# EAGLE design 100mADSR (EAGLE 7.6.0)
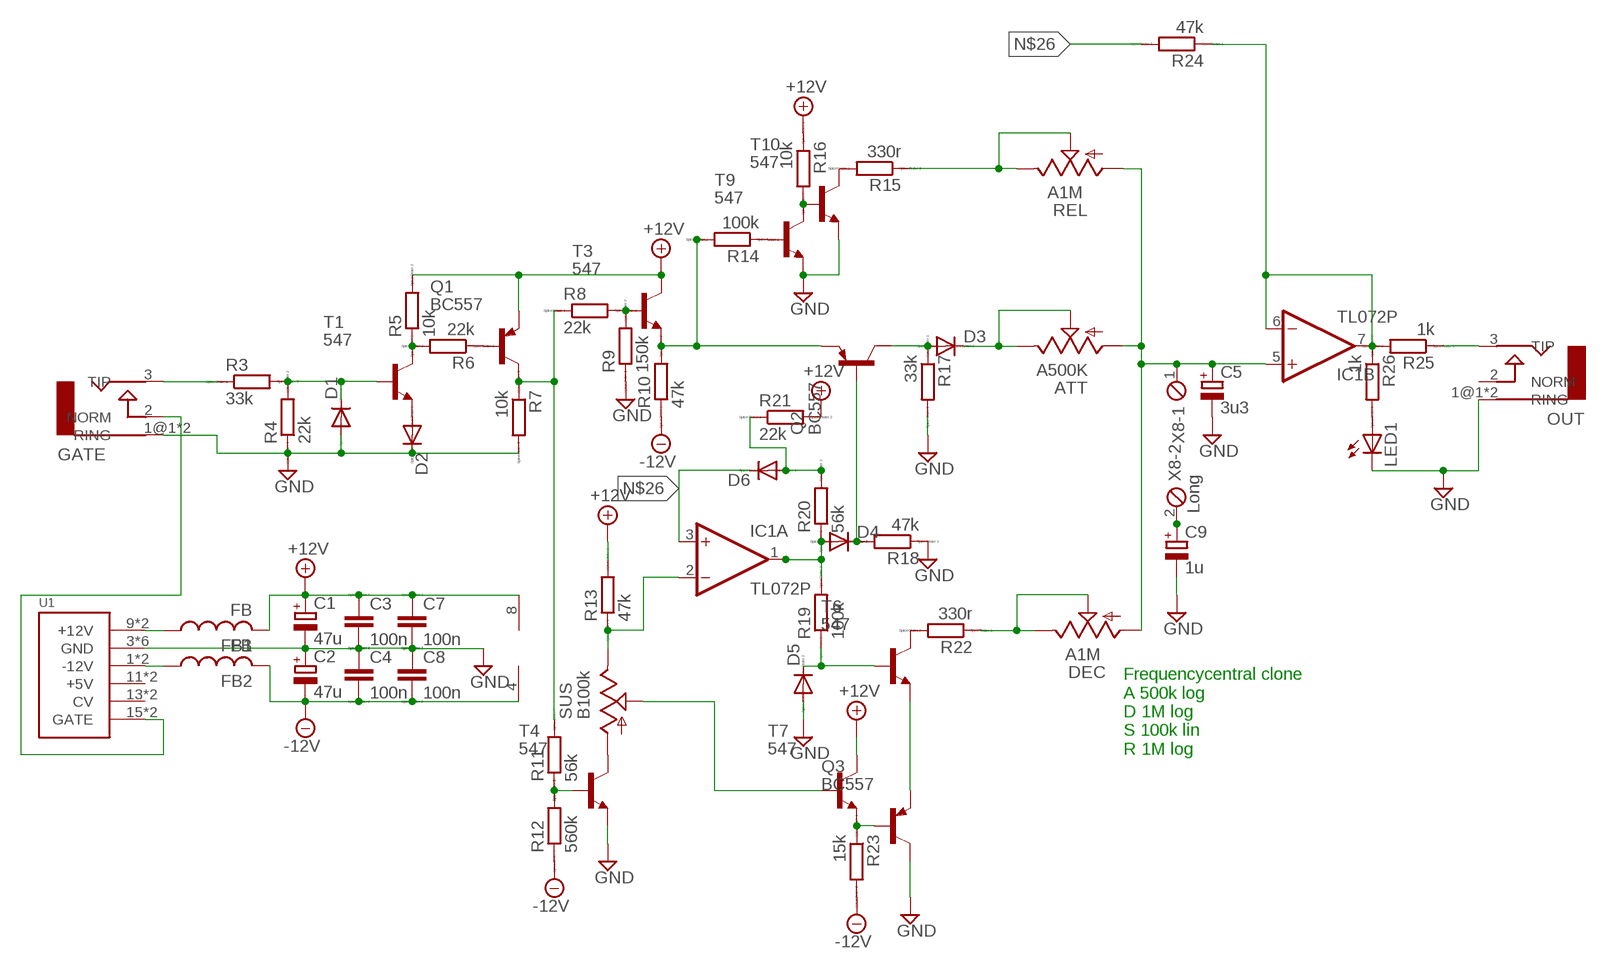
[diagram p0: schematic, sheet 1]

## Parts
ATT  A500K  TRIMSLIDE45  [SLIDEPOT-45]
C1  47u  CPOL-EUE2.5-7  [E2,5-7]
C2  47u  CPOL-EUE2.5-7  [E2,5-7]
C3  100n  C-EU025-025X050  [C025-025X050]
C4  100n  C-EU025-025X050  [C025-025X050]
C5  3u3  CPOL-EUE2.5-6  [E2,5-6]
C7  100n  C-EUC1206K  [C1206K]
C8  100n  C-EUC1206K  [C1206K]
C9  1u  CPOL-EUE2.5-6  [E2,5-6]
D1  1N4148DO35-7  [DO35-7]
D2  1N4148DO35-7  [DO35-7]
D3  1N4148DO35-7  [DO35-7]
D4  1N4148DO35-7  [DO35-7]
D5  1N4148DO35-7  [DO35-7]
D6  1N4148DO35-7  [DO35-7]
DEC  A1M  TRIMSLIDE45  [SLIDEPOT-45]
FB1  FB  [FB]
FB2  FB  [FB]
GATE  AUDIO-JACKERTHENVAR  [ERTHENVAR-JACK]
IC1  TL072P  [DIL08]
LED1  LED3MM  [LED3MM]
OUT  AUDIO-JACKERTHENVAR  [ERTHENVAR-JACK]
Q1  BC557  [TO92-EBC]
Q2  BC557  [TO92-EBC]
Q3  BC557  [TO92-EBC]
R3  33k  R-EU_0204_7  [0204/7]
R4  22k  R-EU_0204_7  [0204/7]
R5  10k  R-EU_0204_7  [0204/7]
R6  22k  R-EU_0204_7  [0204/7]
R7  10k  R-EU_0204_7  [0204/7]
R8  22k  R-EU_0204_7  [0204/7]
R9  150k  R-EU_0204_7  [0204/7]
R10  47k  R-EU_0204_7  [0204/7]
R11  56k  R-EU_0204_7  [0204/7]
R12  560k  R-EU_0204_7  [0204/7]
R13  47k  R-EU_0204_7  [0204/7]
R14  100k  R-EU_0204_7  [0204/7]
R15  330r  R-EU_0204_7  [0204/7]
R16  10k  R-EU_0204_7  [0204/7]
R17  33k  R-EU_0204_7  [0204/7]
R18  47k  R-EU_0204_7  [0204/7]
R19  100k  R-EU_0204_7  [0204/7]
R20  56k  R-EU_0204_7  [0204/7]
R21  22k  R-EU_0204_7  [0204/7]
R22  330r  R-EU_0204_7  [0204/7]
R23  15k  R-EU_0204_7  [0204/7]
R24  47k  R-EU_0204_7  [0204/7]
R25  1k  R-EU_0204_7  [0204/7]
R26  1k  R-EU_0204_7  [0204/7]
REL  A1M  TRIMSLIDE45  [SLIDEPOT-45]
SUS  B100k  TRIMSLIDE45  [SLIDEPOT-45]
T1  547  BC547-NPN-TO92-CBE  [TO92-CBE]
T3  547  BC547-NPN-TO92-CBE  [TO92-CBE]
T4  547  BC547-NPN-TO92-CBE  [TO92-CBE]
T6  547  BC547-NPN-TO92-CBE  [TO92-CBE]
T7  547  BC547-NPN-TO92-CBE  [TO92-CBE]
T9  547  BC547-NPN-TO92-CBE  [TO92-CBE]
T10  547  BC547-NPN-TO92-CBE  [TO92-CBE]
U1  POWER  [POWER_16]
X8  Long  MPT2  [2POL254]

## Nets
+12V: C1.+ C3.1 C7.1 FB1.P$2 IC1.8(P:V+) Q1.E R5.2 R13.2 R16.1 R21.2 T3.C T7.C
-12V: C2.- C4.2 C8.2 FB2.P$2 IC1.4(P:V-) R10.1 R12.1 R23.2
GND: C1.- C2.+ C3.2 C4.1 C5.- C7.2 C8.1 C9.- D1.A D2.C D5.A GATE.1@1(RING) GATE.1@2(RING) LED1.K(C) OUT.1@1(RING) OUT.1@2(RING) Q3.C R4.1 R7.2 R9.1 R17.2 R18.1 T4.E T9.E T10.E U1.3(GND) U1.4(GND) U1.5(GND) U1.6(GND) U1.7(GND) U1.8(GND)
N$1: OUT.3(TIP) R25.1
N$2: R14.1 T9.B
N$3: R16.2 T9.C T10.B
N$4: R15.2 T10.C
N$5: R15.1 REL.B REL.WIPER
N$6: SUS.A T4.C
N$7: D3.A Q2.C R17.1
N$8: D4.C Q2.B R18.2
N$9: D1.C R3.2 R4.2 T1.B
N$10: Q1.B R6.1
N$11: R5.1 R6.2 T1.C
N$12: R11.1 R12.2 T4.B
N$13: GATE.2(NORM) U1.15(GATE) U1.16(GATE)
N$14: IC1.2(A:-IN) R13.1 SUS.B
N$15: D6.A R20.2 R21.1
N$16: D2.A T1.E
N$17: Q1.C R7.1 R8.1 R11.2
N$18: D4.A IC1.1(A:OUT) R19.2 R20.1
N$19: R8.2 R9.2 T3.B
N$20: Q2.E R10.2 R14.2 T3.E
N$21: D5.C R19.1 T6.B
N$22: R22.2 T6.C
N$23: Q3.E T6.E
N$24: Q3.B R23.1 T7.E
N$25: SUS.WIPER T7.B
N$26: D6.C IC1.3(A:+IN) R24.2
N$27: LED1.A R26.2
N$28: ATT.B ATT.WIPER D3.C
N$29: DEC.B DEC.WIPER R22.1
N$30: ATT.A C5.+ DEC.A IC1.5(B:+IN) REL.A X8.1
N$31: IC1.6(B:-IN) IC1.7(B:OUT) R24.1 R25.2 R26.1
N$32: GATE.3(TIP) R3.1
N$37: C9.+ X8.2
N$61: FB1.P$1 U1.9(+12V) U1.10(+12V)
N$62: FB2.P$1 U1.1(-12V) U1.2(-12V)
Unconnected: OUT.2(NORM) U1.11(+5V) U1.12(+5V) U1.13(CV) U1.14(CV)

## Notes on the sheet
- Frequencycentral clone
  A 500k log
  D 1M log
  S 100k lin
  R 1M log

## Library data of the parts
ATT DEC REL SUS = stefan-lochbrunner_EAGLE_master_custom libraries_potentiometers_Bourns PTA series_Bourns PTA series:TRIM: Sliding potentiometers Based on Adafruits (https://github.com/adafruit/Adafruit-Eagle-Library) 'TRIM' device. For Bourns PTA series and TT Electronics PSxx series potentiometers.
C1 C2 C5 C9 = resistor:CPOL-EU: POLARIZED CAPACITOR, European symbol
C3 C4 C7 C8 = resistor:C-EU: CAPACITOR, European symbol; SPICEPREFIX: C
D1-D6 = diode:1N4148: DIODE high speed (Philips)
FB1 FB2 = adafruit:FB: Ferrite bead Digikey #P9821BK-ND
GATE OUT = erthenvar:AUDIO-JACK: Switching Mono 3.5mm Audio Jack from Erthenvar.
IC1 = gm-ics:TL072: OP AMP
LED1 = led:LED: LED OSRAM: - CHIPLED LG R971, LG N971, LY N971, LG Q971, LY Q971, LO R971, LY R971 LH N974, LH R974 LS Q976, LO Q976, LY Q976 LO Q996 - Hyper CHIPLED LW Q18S LB Q993, LB Q99A, LB R99A - SideLED LS A670, LO A670, LY A670, LG A670, LP A670 LB A673, LV A673, LT A673, LW A673 LH A674 LY A675 LS A676, LA A676, LO A676, LY A676, LW A676 LS A679, LY A679, LG A679 - Hyper Micro SIDELED® LS Y876, LA Y876, LO Y876, LY Y876 LT Y87S - SmartLED LW L88C, LW L88S LB L89C, LB L89S, LG L890 LS L89K, LO L89K, LY L89K LS L896, LA L896, LO L896, LY L896 - TOPLED LS T670, LO T670, LY T670, LG T670, LP T670 LSG T670, LSP T670, LSY T670, LOP T670, LYG T670 LG T671, LOG T671, LSG T671 LB T673, LV T673, LT T673, LW T673 LH T674 LS T676, LA T676, LO T676, LY T676, LB T676, LH T676, LSB T676, LW T676 LB T67C, LV T67C, LT T67C, LS T67K, LO T67K, LY T67K, LW E67C LS E67B, LA E67B, LO E67B, LY E67B, LB E67C, LV E67C, LT E67C LW T67C LS T679, LY T679, LG T679 LS T770, LO T770, LY T770, LG T770, LP T770 LB T773, LV T773, LT T773, LW T773 LH T774 LS E675, LA E675, LY E675, LS T675 LS T776, LA T776, LO T776, LY T776, LB T776 LHGB T686 LT T68C, LB T68C - Hyper Mini TOPLED® LB M676 - Mini TOPLED Santana® LG M470 LS M47K, LO M47K, LY M47K Source: http://www.osram.convergy.de LUXEON: - LUMILED® LXK2-PW12-R00, LXK2-PW12-S00, LXK2-PW14-U00, LXK2-PW14-V00 LXK2-PM12-R00, LXK2-PM12-S00, LXK2-PM14-U00 LXK2-PE12-Q00, LXK2-PE12-R00, LXK2-PE12-S00, LXK2-PE14-T00, LXK2-PE14-U00 LXK2-PB12-K00, LXK2-PB12-L00, LXK2-PB12-M00, LXK2-PB14-N00, LXK2-PB14-P00, LXK2-PB14-Q00 LXK2-PR12-L00, LXK2-PR12-M00, LXK2-PR14-Q00, LXK2-PR14-R00 LXK2-PD12-Q00, LXK2-PD12-R00, LXK2-PD12-S00 LXK2-PH12-R00, LXK2-PH12-S00 LXK2-PL12-P00, LXK2-PL12-Q00, LXK2-PL12-R00 Source: www.luxeon.com KINGBRIGHT: KA-3528ASYC Source: www.kingbright.com
Q1-Q3 = transistor-pnp:BC557*: PNP Transistror
R3-R26 = resistor:R-EU_: RESISTOR, European symbol; SPICEPREFIX: R
T1 T3 T4 T6 T7 T9 T10 = transistor:*-NPN-: NPN Transistror BF959 corrected 2008.03.06
U1 = eurorack:POWER
X8 = con-phoenix-254:MPT2: PHOENIX CONNECTOR; OC_FARNELL: unknown; OC_NEWARK: unknown

## Board
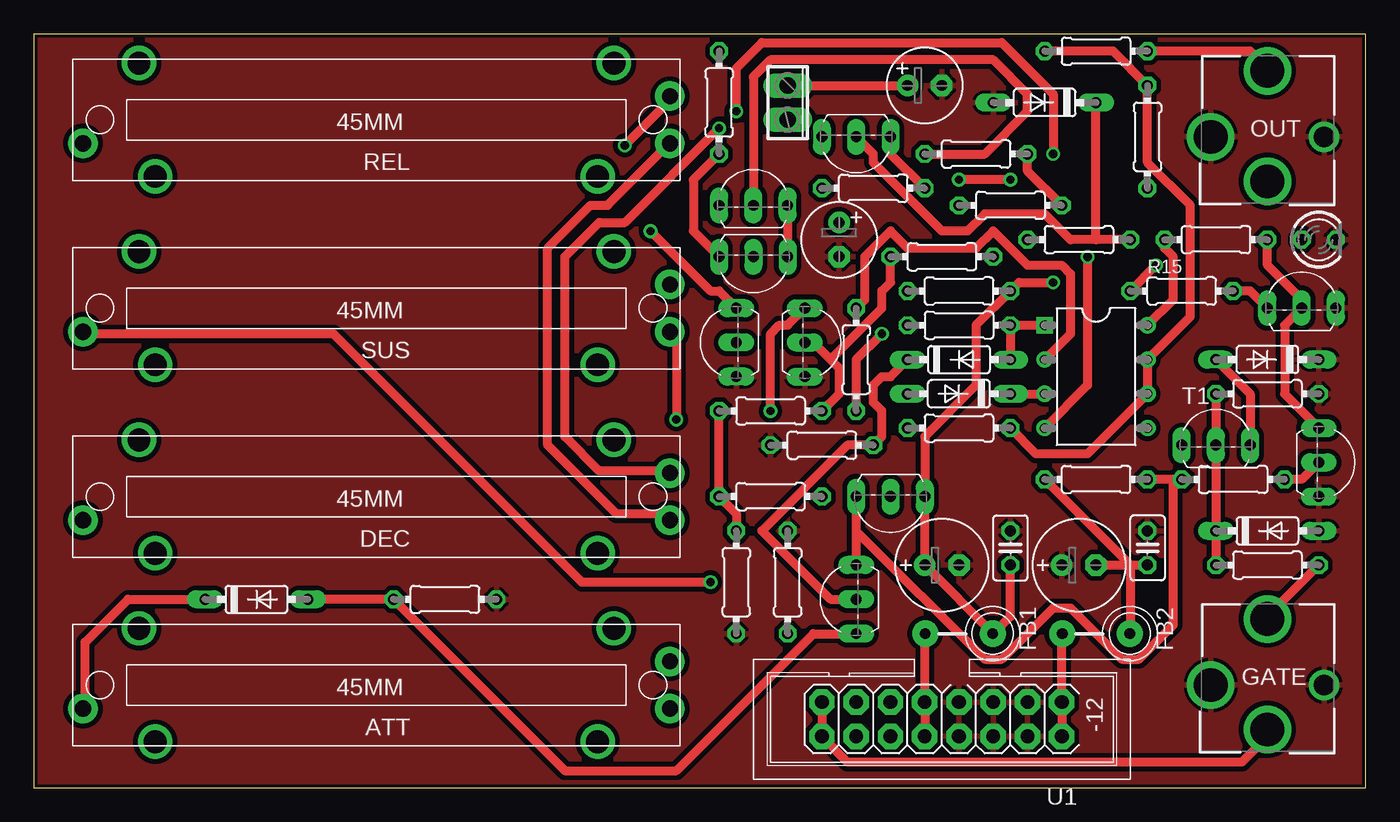
[diagram p1: board, top side]
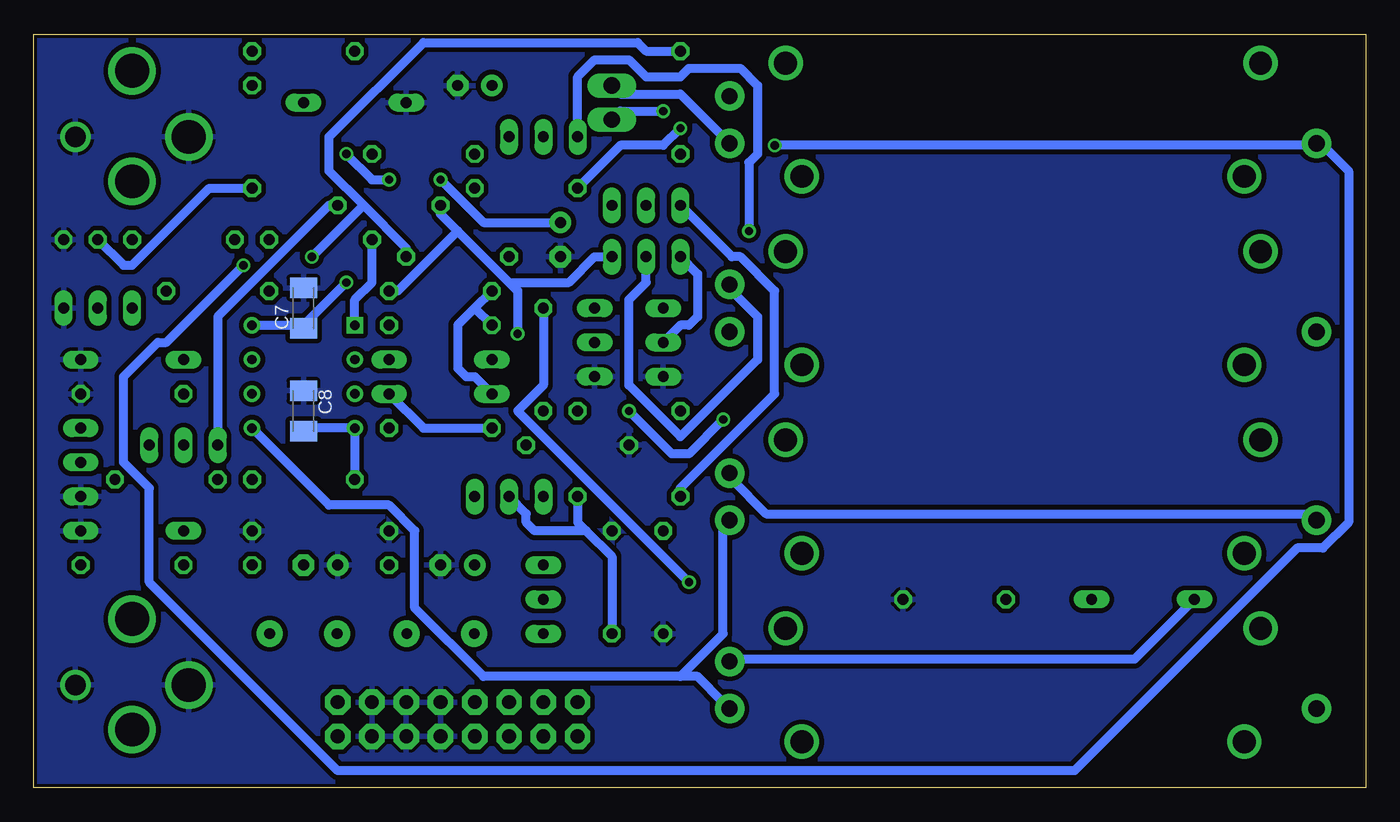
[diagram p2: board, bottom side, seen from below]

Size 98.73 x 55.87 mm. Coordinates in mm from the lower left corner, seen from the top.
Outline: 0,0 98.73,0 98.73,55.87 0,55.87 0,0
Copper layers (1*16): Top 0.035mm / dielectric 1.5mm / Bottom 0.035mm
Design rules "default *": minimum track width 26mil, minimum drill 24mil, track to track 14mil, track to pad 14mil, pad to pad 14mil, via to via 14mil, smd to smd 8mil, copper to edge 10mil, drill to drill 14mil, minimum pad ring 10mil, minimum via ring 8mil, stop-mask expansion 4mil, vias tented up to drill 0mil, thermal gap 10mil

### Footprints (pad centres in the part's own frame; a part is rotated, then mirrored left to right if it is on the bottom)
SLIDEPOT-45 = drill 1.2 pad 2.184: A -21.75,1.75; B 21.75,1.75; WIPER -21.75,-1.75 | drill 1.7 pad 2.54: P$1 -16.4,4.2; P$2 16.4,4.2; P$3 -17.6,-4.2; P$4 17.6,-4.2
E2,5-7 = drill 0.813 pad 1.6: + -1.27,0 | drill 0.813 pad 1.6 octagon: - 1.27,0
C025-025X050 = drill 0.813 octagon: 1 -1.27,0; 2 1.27,0
E2,5-6 = drill 0.813 pad 1.6: + -1.27,0 | drill 0.813 pad 1.6 octagon: - 1.27,0
C1206K = smd 1.5 x 2: 1 -1.5,0; 2 1.5,0
DO35-7 = drill 0.813 long: A 3.81,0; C -3.81,0
FB = drill 0.8 pad 1.93: P$1 -2.5,0; P$2 2.5,0
ERTHENVAR-JACK = drill 2.5: 1@1 -4.2,0; 2 0,-3.3; 3 0,4.9 | drill 1.5: 1@2 4.2,0
DIL08 = drill 0.7 square: 1 -3.81,-3.81 | drill 0.7: 2 -1.27,-3.81; 3 1.27,-3.81; 4 3.81,-3.81; 5 3.81,3.81; 6 1.27,3.81; 7 -1.27,3.81; 8 -3.81,3.81
LED3MM = drill 0.813 octagon: A -1.27,0; K 1.27,0
TO92-EBC = drill 0.813 long: B 0,-1.27; C -2.54,-1.27; E 2.54,-1.27
0204/7 = drill 0.813 octagon: 1 -3.81,0; 2 3.81,0
TO92-CBE = drill 0.813 long: B 0,0; C -2.54,0; E 2.54,0
POWER_16 = drill 1.016 pad 1.88 octagon: 1 -6.35,-1.27; 2 -6.35,1.27; 3 -3.81,-1.27; 4 -3.81,1.27; 5 -1.27,-1.27; 6 -1.27,1.27; 7 1.27,-1.27; 8 1.27,1.27; 9 3.81,-1.27; 10 3.81,1.27; 11 6.35,-1.27; 12 6.35,1.27; 13 8.89,-1.27; 14 8.89,1.27; 15 11.43,-1.27; 16 11.43,1.27
2POL254 = drill 1.2 long: 1 -1.27,0; 2 1.27,0

### Placement (x,y rotation side)
ATT  25.4,7.62 180 top
C1  67.31,16.51 0 top
C2  77.47,16.51 0 top
C3  72.39,17.78 90 top
C4  82.55,17.78 270 top
C5  66.04,52.07 0 top
C7  78.74,35.56 90 bottom
C8  78.74,27.94 270 bottom
C9  59.69,40.64 270 top
D1  91.44,19.05 0 top
D2  91.44,31.75 180 top
D3  16.51,13.97 0 top
D4  68.58,31.75 0 top
D5  74.93,50.8 180 top
D6  68.58,29.21 180 top
DEC  25.4,21.59 180 top
FB1  68.58,11.43 0 top
FB2  78.74,11.43 0 top
GATE  91.44,7.62 0 top
IC1  78.74,30.48 270 top
LED1  95.25,40.64 0 top
OUT  91.44,48.26 0 top
Q1  53.34,44.45 0 top
Q2  59.69,13.97 90 top
Q3  50.8,33.02 90 top
R3  91.44,16.51 180 top
R4  91.44,29.21 180 top
R5  72.39,43.18 180 top
R6  69.85,46.99 0 top
R7  52.07,15.24 270 top
R8  54.61,21.59 0 top
R9  55.88,15.24 270 top
R10  78.74,22.86 0 top
R11  54.61,27.94 180 top
R12  67.31,39.37 180 top
R13  60.96,31.75 270 top
R14  88.9,22.86 180 top
R15  85.09,36.83 0 top
R16  87.63,40.64 0 top
R17  30.48,13.97 0 top
R18  58.42,25.4 0 top
R19  77.47,40.64 180 top
R20  68.58,34.29 180 top
R21  68.58,36.83 0 top
R22  62.23,44.45 0 top
R23  50.8,50.8 90 top
R24  68.58,26.67 180 top
R25  78.74,54.61 180 top
R26  82.55,48.26 270 top
REL  25.4,49.53 180 top
SUS  25.4,35.56 180 top
T1  87.63,25.4 0 top
T3  63.5,21.59 180 top
T4  57.15,33.02 270 top
T6  60.96,48.26 180 top
T7  53.34,39.37 180 top
T9  95.25,24.13 270 top
T10  93.98,35.56 0 top
U1  69.85,5.08 180 top
X8  55.88,50.8 270 top

### Tracks (layer width: path | path; a pad name or v marks a point on that pad's centre or on a via)
+12V  (via drill 0.61)
  Top 0.66: C3.1 72.39,12.7 71.12,11.43 | 71.12,11.43 C1.+ T3.C 66.04,26.04 69.85,29.84 69.85,34.29 R21.2 73.03,37.47 v75.56,37.47 | 71.12,11.43 FB1.P$2 | R16.1 83.82,40.01 84.45,39.37 84.45,36.2 IC1.8 | Q1.E T7.C | R13.2 60.96,31.75 v62.87,33.66
  Bottom 0.66: IC1.8 78.74,34.29 | v62.87,33.66 62.87,36.83 63.5,37.47 | 67.31,41.27 68.58,42.55 R5.2 | 67.31,41.27 63.5,37.47 | R21.2 71.75,36.83 67.31,41.27 | T7.C 57.15,39.37 59.05,37.47 63.5,37.47 | v75.56,37.47 78.74,34.29 | 78.74,34.29 C7.1
-12V  (via drill 0.61)
  Top 0.66: C2.- 81.28,16.51 | 81.28,16.51 C4.2 | 81.28,16.51 81.28,11.43 FB2.P$2 | 81.28,16.51 R10.1 | IC1.4 78.11,29.84 v78.11,39.37
  Bottom 0.66: C8.2 78.74,26.67 IC1.4 R10.1 | R23.2 53.34,54.61 53.98,55.24 69.85,55.24 76.83,48.26 76.83,45.72 74.3,43.18 | 74.3,43.18 71.12,40.01 R12.1 | 74.3,43.18 v78.11,39.37
GND
  pour Bottom: 0,59.69 99.06,59.69 99.06,0 0,0
  pour Top: -1.27,59.69 100.33,59.69 100.33,-1.27 -1.27,-1.27
N$1
  Top 0.66: R25.1 90.17,54.61 91.44,53.34 OUT.3
N$2
  Top 0.66: R14.1 93.98,22.86 T9.B
N$3
  Top 0.66: T9.C 92.71,29.21 92.71,34.29 T10.B 93.98,36.2 91.44,38.73 R16.2
N$4
  Top 0.66: R15.2 90.17,36.83 T10.C
N$5  (via drill 0.61)
  Top 0.66: v83.19,38.73 R15.1 | v43.81,47.62 46.99,50.8 REL.WIPER
  Bottom 0.66: v83.19,38.73 88.9,33.02 89.53,33.02 92.08,30.48 92.08,24.13 90.17,22.23 90.17,15.24 76.2,1.27 21.59,1.27 5.08,17.78 3.17,17.78 1.27,19.68 1.27,45.72 3.17,47.62 REL.B 3.81,47.62 v43.81,47.62
N$6  (via drill 0.61)
  Top 0.66: T4.C 55.88,34.29 55.24,34.29 54.61,33.66 v54.61,27.94 | v47.62,27.3 47.62,33.66 SUS.A
  Bottom 0.66: v54.61,27.94 51.44,24.77 50.16,24.77 v47.62,27.3
N$7
  Top 0.66: D3.A R17.1 39.37,1.27 47.62,1.27 57.78,11.43 Q2.C
N$8
  Top 0.66: Q2.B 59.05,13.97 53.98,19.05 60.33,25.4 R18.2 62.87,26.04 62.87,27.94 62.23,28.57 62.23,29.84 62.87,30.48 63.5,30.48 D4.C
N$9
  Top 0.66: R3.2 D1.C T1.B R4.2
N$10
  Top 0.66: Q1.B 53.34,52.7 54.61,53.98 71.12,53.98 73.66,51.44 73.66,50.16 70.48,46.99 R6.1
N$11
  Top 0.66: R6.2 73.66,45.72 R5.1
  Bottom 0.66: T1.C 85.09,34.92 76.83,43.18 R5.1
N$12
  Top 0.66: R11.1 59.69,29.21 59.69,31.11 59.05,31.75 | 59.05,31.75 57.78,33.02 T4.B | R12.2 63.5,37.47 62.87,36.83 62.87,35.56 59.05,31.75
N$13
  Top 0.66: U1.15 U1.16 60.33,1.91 89.53,1.91 91.44,3.81 GATE.2
N$14  (via drill 0.61)
  Top 0.66: IC1.2 76.83,33.66 76.83,38.1 76.2,38.73 73.66,38.73 71.12,41.27 69.85,40.01 64.77,40.01 63.5,41.27 61.59,39.37 61.59,36.2 R13.1 | v50.16,15.24 40.64,15.24 22.23,33.66 3.81,33.66 SUS.B
  Bottom 0.66: v50.16,15.24 62.87,27.94 60.96,29.84 R13.1
N$15
  Bottom 0.66: D6.A 66.04,30.48 66.67,30.48 67.31,31.11 67.31,34.29 66.04,35.56 | R21.1 66.04,35.56 | 66.04,35.56 R20.2
N$16
  Top 0.66: T1.E 90.17,29.21 D2.A
N$17
  Top 0.66: R7.1 52.07,20.32 R8.1 R11.2
  Bottom 0.66: Q1.C 46.99,39.37 46.35,39.37 43.81,36.83 43.81,29.21 50.8,22.23 R8.1
N$18
  Top 0.66: IC1.1 R20.1 D4.A
  Bottom 0.66: R19.2 73.66,37.47 74.93,36.2 IC1.1
N$19
  Bottom 0.66: R9.2 55.88,17.14 57.78,19.05 | 57.78,19.05 58.42,19.68 R8.2 | T3.B 62.23,20.32 62.23,19.68 61.59,19.05 57.78,19.05
N$20
  Top 0.66: 84.45,22.86 R10.2 | T3.E 60.96,19.05 | 60.96,19.05 Q2.E | 84.45,22.86 84.45,12.06 81.92,9.53 80.64,9.53 76.83,13.34 75.56,13.34 71.75,9.53 70.48,9.53 60.96,19.05 | 84.45,22.86 R14.2
N$21
  Top 0.66: T6.B 62.23,46.99 62.23,46.35 67.31,41.27 69.22,41.27 70.48,42.55 74.93,42.55 76.83,40.64 78.74,40.64 | R19.1 78.74,40.64 | 78.74,40.64 D5.C
N$22
  Top 0.66: T6.C 63.5,46.99 R22.2
N$23  (via drill 0.61)
  Top 0.66: Q3.E 50.8,36.83 50.16,36.83 v45.72,41.27
  Bottom 0.66: v45.72,41.27 45.72,46.35 45.09,46.99 45.09,52.07 46.35,53.34 50.16,53.34 50.8,52.7 53.34,52.7 54.61,53.98 57.15,53.98 58.42,52.7 T6.E
N$24
  Top 0.66: T7.E 48.9,41.27 48.9,45.09 R23.1
  Bottom 0.66: Q3.B 50.8,34.29 50.16,34.29 49.53,34.92 49.53,38.1 T7.E
N$25
  Bottom 0.66: T7.B 53.34,37.47 54.61,36.2 54.61,29.84 50.8,26.04 45.09,31.75 45.09,34.92 46.99,36.83 SUS.WIPER
N$26
  Top 0.66: D6.C IC1.3
  Bottom 0.66: R24.2 69.85,26.67 D6.C
N$27
  Bottom 0.66: R26.2 85.72,44.45 91.44,38.73 92.08,38.73 LED1.A
N$28
  Top 0.66: D3.C 6.99,13.97 3.81,10.79 3.81,6.35 ATT.B
  Bottom 0.66: D3.C 17.14,9.53 46.99,9.53 ATT.WIPER
N$29  (via drill 0.61)
  Top 0.66: v50.8,48.9 43.81,41.91 41.91,41.91 39.37,39.37 39.37,26.04 41.91,23.5 46.99,23.5 DEC.WIPER
  Bottom 0.66: R22.1 55.24,47.62 52.07,47.62 v50.8,48.9 | DEC.B 3.81,20.32 44.45,20.32 46.99,22.86 DEC.WIPER
N$30
  Top 0.66: X8.1 C5.+ | REL.A 46.99,47.62 42.55,43.18 41.27,43.18 38.1,40.01 38.1,25.4 43.18,20.32 46.99,20.32 DEC.A
  Bottom 0.66: X8.1 55.24,51.44 50.8,51.44 47.62,48.26 REL.A | IC1.5 76.83,20.95 72.39,20.95 70.48,19.05 70.48,13.34 65.41,8.26 50.8,8.26 | 50.8,8.26 49.53,8.26 47.62,6.35 ATT.A | 50.8,8.26 47.62,11.43 47.62,19.68 DEC.A
N$31
  Top 0.66: R25.2 80.01,54.61 R26.1 82.55,46.35 85.72,43.18 85.72,34.92 IC1.7 IC1.6 78.11,24.77 74.3,24.77 R24.1
N$32
  Top 0.66: R3.1 91.44,12.7 GATE.3
N$37  (via drill 0.61)
  Top 0.66: v72.39,45.09 v68.58,45.09 | v75.56,46.99 75.56,51.44 71.75,55.24 53.98,55.24 52.07,53.34 v52.07,50.16
  Bottom 0.66: C9.+ 65.41,41.91 v68.58,45.09 | v72.39,45.09 73.66,45.09 v75.56,46.99 | v52.07,50.16 55.24,50.16 X8.2
N$61
  Top 0.66: U1.10 U1.9 66.04,11.43 FB1.P$1
N$62
  Top 0.66: U1.2 U1.1 76.2,11.43 FB2.P$1